# EAGLE design eCog104_Joystick_PSP_Slide (EAGLE 6.6.0)
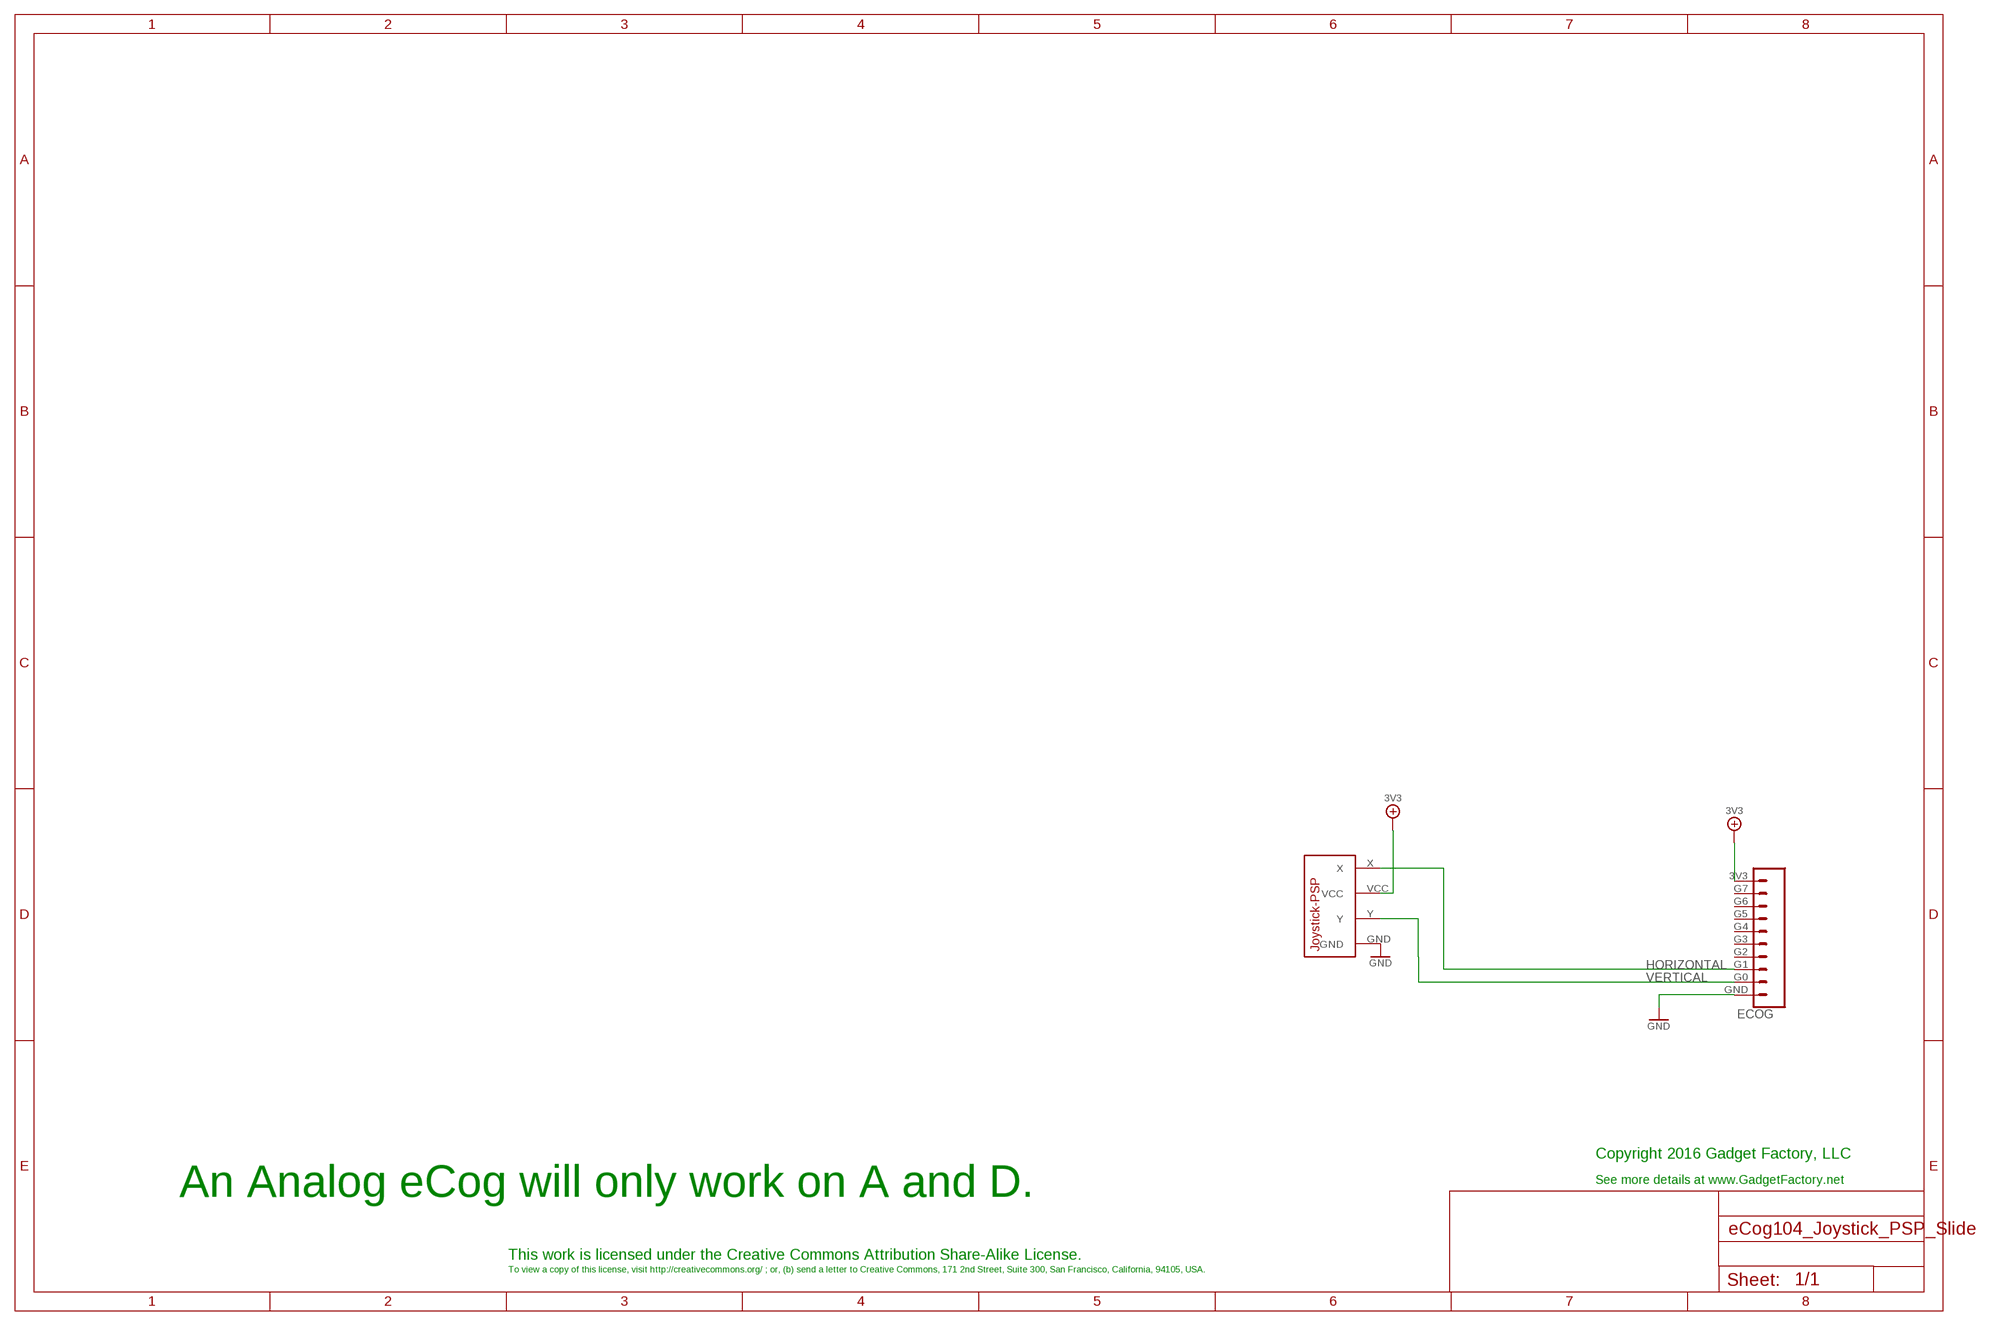
[diagram p0: schematic, sheet 1]

## Parts
ECOG  ECOG_GENERAL_ROWECOG_GENERAL_SMD  [ECOG_GENERAL_SMD]
U$4  JOYSTICK-PSP1000  [JOYSTICK-PSP1000]

## Nets
3V3: ECOG.3V3 U$4.VCC
GND: ECOG.GND U$4.GND
HORIZONTAL: ECOG.G1 U$4.X
VERTICAL: ECOG.G0 U$4.Y
Unconnected: ECOG.G2 ECOG.G3 ECOG.G4 ECOG.G5 ECOG.G6 ECOG.G7

## Notes on the sheet
- Copyright 2016 Gadget Factory, LLC
- See more details at www.GadgetFactory.net
- An Analog eCog will only work on A and D.
- This work is licensed under the Creative Commons Attribution Share-Alike License.
- To view a copy of this license, visit http://creativecommons.org/ ; or, (b) send a letter to Creative Commons, 171 2nd Street, Suite 300, San Francisco, California, 94105, USA.

## Library data of the parts
ECOG = eCogs:ECOG_GENERAL_ROW; DIGIKEY: S1013EC-10-ND
U$4 = SparkFun:JOYSTICK-PSP1000: This is a footprint for the PSP-1000 Joystick. 4-pins: X, Y, Vcc and GND; SPARKFUN: COM-09426

## Board
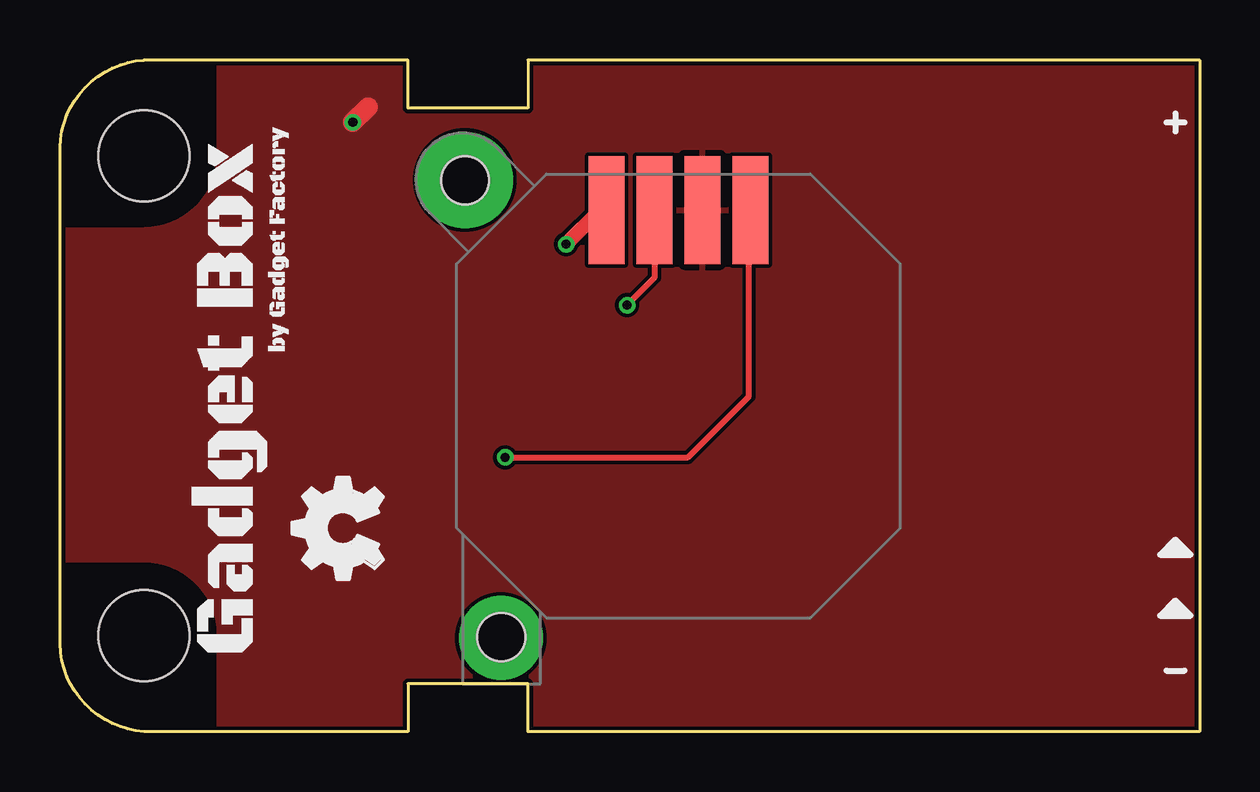
[diagram p1: board, top side]
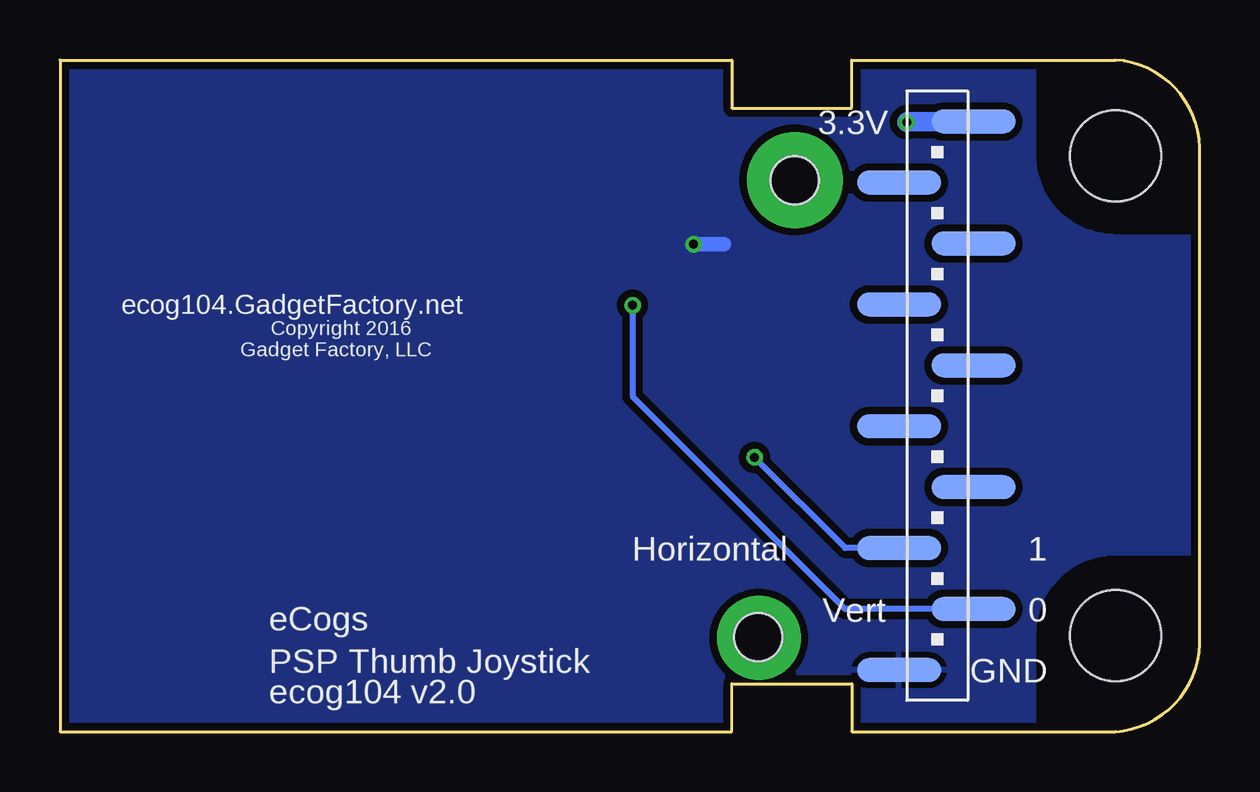
[diagram p2: board, bottom side, seen from below]

Size 47.51 x 28 mm. Coordinates in mm from the lower left corner, seen from the top.
Copper layers (1*16): Top 0.035mm / dielectric 1.5mm / Bottom 0.035mm
Design rules "hackvana *": minimum track width 6mil, minimum drill 0.3mm, track to track 6mil, track to pad 6mil, pad to pad 6mil, via to via 6mil, smd to smd 0mil, copper to edge 6mil, drill to drill 6mil, minimum pad ring 10mil, minimum via ring 6mil, stop-mask expansion 2mil, vias tented up to drill 100mil, thermal gap 10mil

### Footprints (pad centres in the part's own frame; a part is rotated, then mirrored left to right if it is on the bottom)
ECOG_GENERAL_SMD = smd 3.5 x 1 bottom: 3V3 9.923,25.429; G0 9.923,5.111; G1 13.022,7.649; G2 9.923,10.189; G3 13.022,12.729; G4 9.923,15.269; G5 13.022,17.809; G6 9.923,20.349; G7 13.022,22.889; GND 13.022,2.571 | hole 3.8: 4,24; 4,4
JOYSTICK-PSP1000 = smd 1.5 x 4.5: GND -3,7.75; VCC 1,7.75; X 3,7.75; Y -1,7.75 | hole 2: -8.89,8.985; -7.375,-10.06

### Placement (x,y rotation side)
ECOG  -0.49,0 0 top
U$1  [LEGEND_ANALOG]  46.5,5.08 0 top
U$2  [LEGEND_ANALOG]  46.5,7.62 0 top
U$3  [GADGETBOX_SMALL]  7.13,13.97 90 top
U$4  25.78,14 0 top
U$5  [OSHW_FILLX150_NOTEXT]  13.48,6.35 90 top

### Tracks (layer width: path | path; a pad name or v marks a point on that pad's centre or on a via)
3V3  (via drill 0.38)
  Top 0.813: v12.21,25.4 12.84,26.04
  Bottom 0.813: ECOG.3V3 12.18,25.43 v12.21,25.4
  pour Top: -1.76,29.27 48.78,29.27 48.78,-1.27 -1.76,-1.27
GND  (via drill 0.38)
  Top 0.61: U$4.GND 22.53,21.75 v21.1,20.32
  Bottom 0.61: v21.1,20.32 19.83,20.32
  pour Bottom (isolate 0.305): -3.03,30.54 50.05,30.54 50.05,-2.54 -3.03,-2.54
HORIZONTAL  (via drill 0.38)
  Top 0.254: v18.56,11.43 26.18,11.43 28.72,13.97 28.72,21.69 U$4.X
  Bottom 0.254: ECOG.G1 14.78,7.65 v18.56,11.43
N$1  (via drill 2 pad 4)
  other vias: 16.88,23
N$2  (via drill 2 pad 3.5)
  other vias: 18.38,3.9
VERTICAL  (via drill 0.38)
  Top 0.254: U$4.Y 24.78,18.92 v23.64,17.78
  Bottom 0.254: ECOG.G0 14.78,5.11 23.64,13.97 v23.64,17.78

### Text on the board
bPlace: 3.3V | Copyright 2016 | ecog104.GadgetFactory.net | Gadget Factory, LLC | 1 | Horizontal | 0 | Vert | eCogs | GND | PSP Thumb Joystick | ecog104 v2.0